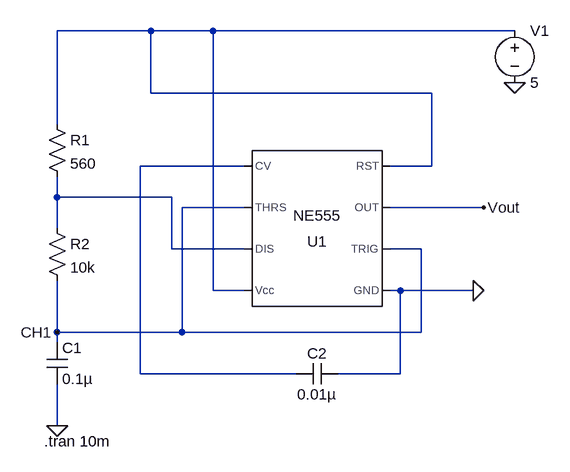
[diagram p0: schematic astable_-555.asc]
astable_-555.asc, the LTspice schematic file:
Version 4
SHEET 1 880 680
WIRE -32 -112 -176 -112
WIRE 64 -112 -32 -112
WIRE 528 -112 64 -112
WIRE -32 -16 -32 -112
WIRE 400 -16 -32 -16
WIRE -176 32 -176 -112
WIRE 112 96 -48 96
WIRE 400 96 400 -16
WIRE 400 96 336 96
WIRE -176 144 -176 112
WIRE 0 144 -176 144
WIRE 112 160 16 160
WIRE 480 160 336 160
WIRE -176 192 -176 144
WIRE 0 224 0 144
WIRE 112 224 0 224
WIRE 384 224 336 224
WIRE 64 288 64 -112
WIRE 112 288 64 288
WIRE 352 288 336 288
WIRE 464 288 352 288
WIRE -176 352 -176 272
WIRE 16 352 16 160
WIRE 16 352 -176 352
WIRE 384 352 384 224
WIRE 384 352 16 352
WIRE -176 368 -176 352
WIRE -48 416 -48 96
WIRE 192 416 -48 416
WIRE 352 416 352 288
WIRE 352 416 256 416
WIRE -176 496 -176 432
FLAG 464 288 0
FLAG -176 496 0
FLAG 480 160 Vout
FLAG 528 -32 0
FLAG -176 352 CH1
SYMBOL Misc\\NE555 224 192 R180
SYMATTR InstName U1
SYMBOL voltage 528 -128 R0
WINDOW 123 0 0 Left 0
WINDOW 39 0 0 Left 0
SYMATTR InstName V1
SYMATTR Value 5
SYMBOL res -192 16 R0
SYMATTR InstName R1
SYMATTR Value 560
SYMBOL res -192 176 R0
SYMATTR InstName R2
SYMATTR Value 10k
SYMBOL cap -192 368 R0
SYMATTR InstName C1
SYMATTR Value 0.1µ
SYMBOL cap 256 400 R90
WINDOW 0 0 32 VBottom 2
WINDOW 3 32 32 VTop 2
SYMATTR InstName C2
SYMATTR Value 0.01µ
TEXT -196 520 Left 2 !.tran 10m

The netlist it stands for:
* astable_-555.asc
XU1 0 CH1 Vout N001 N002 CH1 N003 N001 NE555  ; pins GND TRIG OUT RST CV THRS DIS Vcc
V1 N001 0 5
R1 N001 N003 560
R2 N003 CH1 10k
C1 CH1 0 0.1µ
C2 0 N002 0.01µ
.tran 10m
.lib NE555.sub
.backanno
.end